# Altium schematic sheet Espectrometro_Peri.SchDoc
size A4
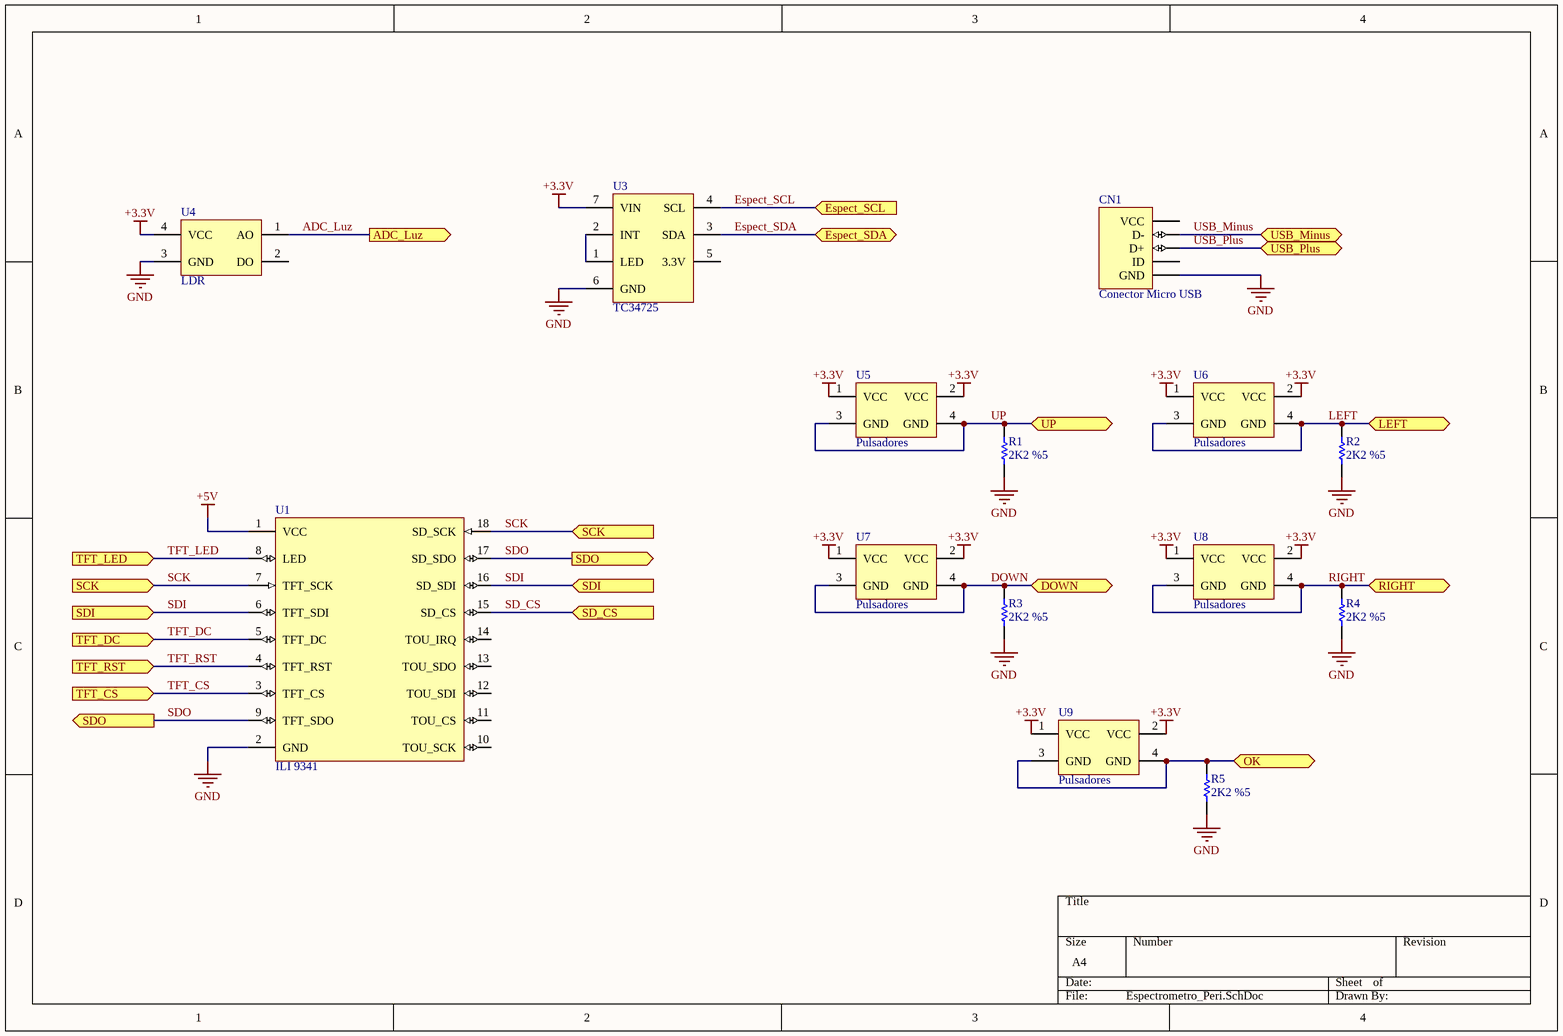
[diagram p0: Espectrometro_Peri.SchDoc]

## Parts
CN1  Conector Micro USB  [C8320-05BFRIB0R]
R1  2K2 %5  [R_400]
R2  2K2 %5  [R_400]
R3  2K2 %5  [R_400]
R4  2K2 %5  [R_400]
R5  2K2 %5  [R_400]
U1  ILI 9341  [Pantalla_TFT_2.4"]
U3  TC34725  [TC34725]
U4  LDR  [HEADER_M-4x1_0.1"_H]
U5  Pulsadores  [Tact Switch TH]
U6  Pulsadores  [Tact Switch TH]
U7  Pulsadores  [Tact Switch TH]
U8  Pulsadores  [Tact Switch TH]
U9  Pulsadores  [Tact Switch TH]

## Ports
ADC_Luz (out), DOWN (bidir), Espect_SCL (in), Espect_SDA (bidir), LEFT (bidir), OK (bidir), RIGHT (bidir), SCK (in), SD_CS (in), SDI (in), SDO (out), TFT_CS (in), TFT_DC (in), TFT_LED (in), TFT_RST (in), UP (bidir), USB_Minus (bidir), USB_Plus (bidir)

## Nets
+3.3V: U3.7(VIN) U4.4(VCC) U5.1(VCC) U5.2(VCC) U6.1(VCC) U6.2(VCC) U7.1(VCC) U7.2(VCC) U8.1(VCC) U8.2(VCC) U9.1(VCC) U9.2(VCC)
+5V: U1.1(VCC)
GND: CN1.5(GND) R1.2 R2.2 R3.2 R4.2 R5.2 U1.2(GND) U3.6(GND) U4.3(GND)
ADC_Luz: U4.1(AO) ; port ADC_Luz
DOWN: R3.1 U7.3(GND) U7.4(GND) ; port DOWN
Espect_SCL: U3.4(SCL) ; port Espect_SCL
Espect_SDA: U3.3(SDA) ; port Espect_SDA
LEFT: R2.1 U6.3(GND) U6.4(GND) ; port LEFT
OK: R5.1 U9.3(GND) U9.4(GND) ; port OK
RIGHT: R4.1 U8.3(GND) U8.4(GND) ; port RIGHT
SCK: U1.7(TFT_SCK) U1.18(SD_SCK) ; port SCK
SD_CS: U1.15(SD_CS) ; port SD_CS
SDI: U1.6(TFT_SDI) U1.16(SD_SDI) ; port SDI
SDO: U1.9(TFT_SDO) U1.17(SD_SDO) ; port SDO
TFT_CS: U1.3(TFT_CS) ; port TFT_CS
TFT_DC: U1.5(TFT_DC) ; port TFT_DC
TFT_LED: U1.8(LED) ; port TFT_LED
TFT_RST: U1.4(TFT_RST) ; port TFT_RST
UP: R1.1 U5.3(GND) U5.4(GND) ; port UP
USB_Minus: CN1.2(D-) ; port USB_Minus
USB_Plus: CN1.3(D+) ; port USB_Plus
NetU3_1: U3.1(LED) U3.2(INT)

Not connected (* = marked no-connect by the designer): CN1 1(VCC) 4(ID); U1 10(TOU_SCK) 11(TOU_CS) 12(TOU_SDI) 13(TOU_SDO) 14(TOU_IRQ); U3 5(3.3V); U4 2(DO)

## Library data of the parts
CN1 = Conector Micro USB: Conector Micro USB Type B
R1-R5 = Resistencia: Resistor; Footprint Version: v1.0; Packaging: *; Author: Franco Mendez
U1 = PantallaTFT: Pantalla TFT 2.4"
U3 = TC34725: Sensor RGB
U4 = LDR: Sensor LDR para medir Int.Luz
U5-U9 = Pulsadores: Tact Switch